# EAGLE design Schnuppi (EAGLE 7.7.0)
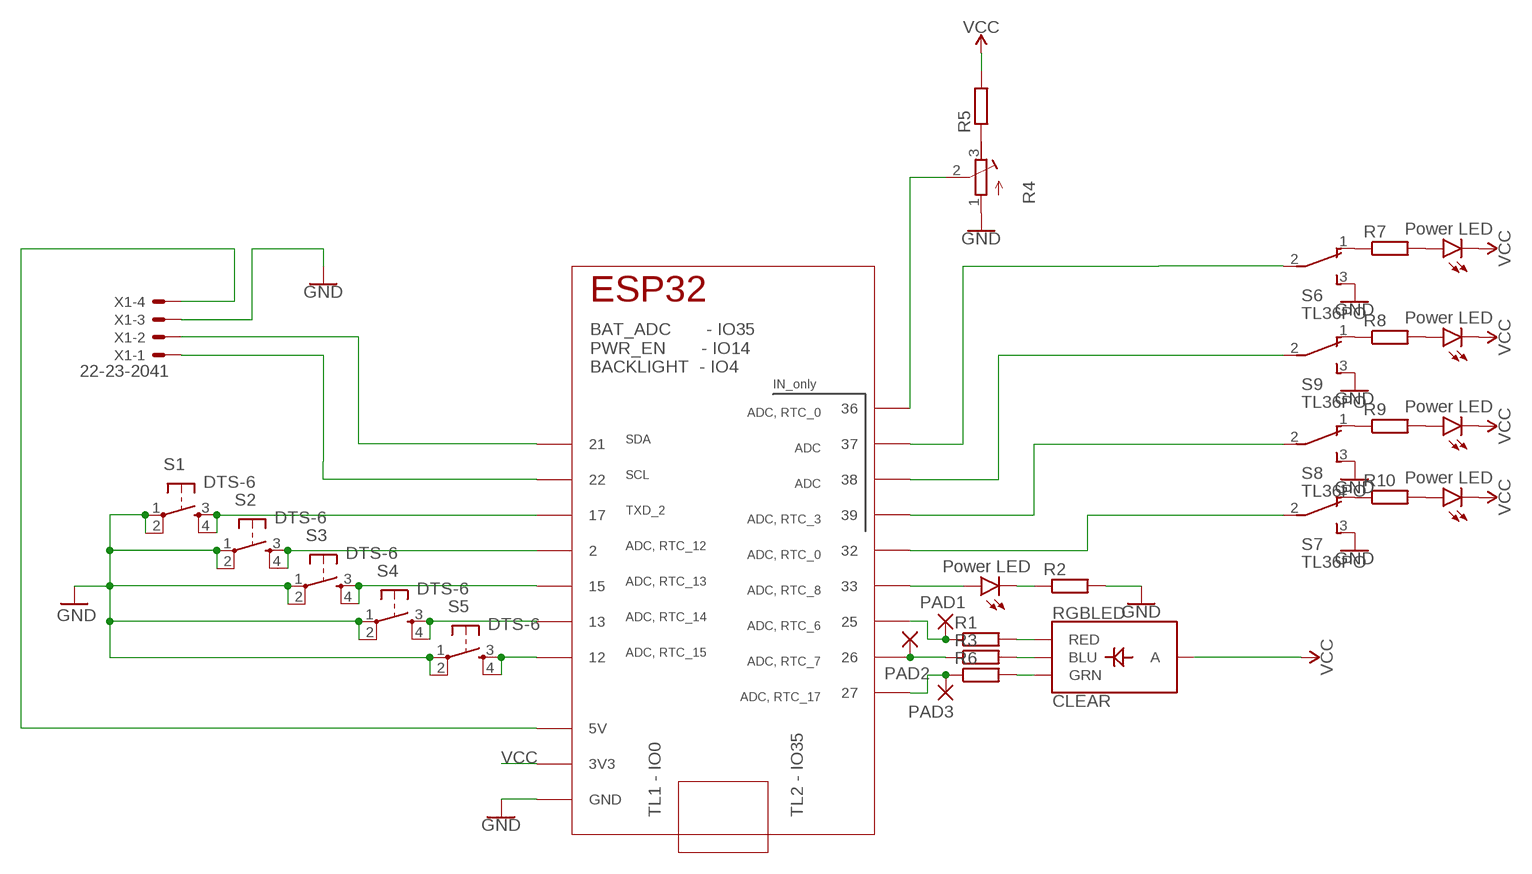
[diagram p0: schematic, sheet 1]

## Parts
IC1  TTGO_DISP  [TTGO_DISP_DEFAULT]
P1  Power LED  LED5MM  [LED_5MM]
P2  Power LED  LED5MM  [LED_5MM]
P3  Power LED  LED5MM  [LED_5MM]
P4  Power LED  LED5MM  [LED_5MM]
P5  Power LED  LED5MM  [LED_5MM]
PAD1  SMD5  [SMD2,54-5,08]
PAD2  SMD5  [SMD2,54-5,08]
PAD3  SMD5  [SMD2,54-5,08]
R1  R-EU_V234/12  [V234/12]
R2  R-EU_V234/12  [V234/12]
R3  R-EU_V234/12  [V234/12]
R4  R-TRIMM64Y  [RTRIM64Y]
R5  R-EU_V234/12  [V234/12]
R6  R-EU_V234/12  [V234/12]
R7  R-EU_V234/12  [V234/12]
R8  R-EU_V234/12  [V234/12]
R9  R-EU_V234/12  [V234/12]
R10  R-EU_V234/12  [V234/12]
RGBLED  CLEAR  LED-RGB-CACLEAR  [LED-RGB-THRU]
S1  DTS-6  [DTS-6]
S2  DTS-6  [DTS-6]
S3  DTS-6  [DTS-6]
S4  DTS-6  [DTS-6]
S5  DTS-6  [DTS-6]
S6  TL36PO  [TL3XPO]
S7  TL36PO  [TL3XPO]
S8  TL36PO  [TL3XPO]
S9  TL36PO  [TL3XPO]
X1  22-23-2041  [22-23-2041]

## Nets
GND: IC1.GND_1(GND) IC1.GND_2(GND) IC1.GND_3(GND) IC1.GND_4(GND) IC1.GND_5(GND) R2.2 R4.1(A) S1.1 S1.2 S2.1 S2.2 S3.1 S3.2 S4.1 S4.2 S5.1 S5.2 S6.3(S) S7.3(S) S8.3(S) S9.3(S)
N$1: IC1.12 S5.3 S5.4
N$2: IC1.13 S4.3 S4.4
N$3: IC1.15 S3.3 S3.4
N$4: IC1.2 S2.3 S2.4
N$5: IC1.17 S1.3 S1.4
N$6: R4.3(E) R5.1
N$7: IC1.36 R4.2(S)
N$8: IC1.25 PAD1.1(P) R1.1
N$10: IC1.27 PAD3.1(P) R6.1
N$11: IC1.26 PAD2.1(P) R3.1
N$12: IC1.33 P2.A
N$13: P2.K(C) R2.1
N$14: IC1.22 X1.1
N$15: R1.2 RGBLED.1(RED)
N$16: R3.2 RGBLED.4(BLU)
N$17: R6.2 RGBLED.3(GRN)
N$18: IC1.5V X1.4
N$19: IC1.37 S6.2(P)
N$20: IC1.39 S8.2(P)
N$21: IC1.32 S7.2(P)
N$22: IC1.38 S9.2(P)
N$23: R10.1 S7.1(O)
N$24: R9.1 S8.1(O)
N$25: R8.1 S9.1(O)
N$26: R7.1 S6.1(O)
N$27: P1.A R7.2
N$28: P3.A R8.2
N$29: P4.A R9.2
N$30: P5.A R10.2
N$31: X1.3 ; supply symbol labelled GND
N$32: IC1.21 X1.2
VCC: IC1.3V3_1(3V3) IC1.3V3_2(3V3) P1.K(C) P3.K(C) P4.K(C) P5.K(C) R5.2 RGBLED.2(A)

## Library data of the parts
IC1 = TTGO_LCD_DISP:TTGO_DISP; HEIGHT: 11
P1-P5 = SparkFun-LED:LED: LED (Generic) Standard schematic elements and footprints for 5mm, 3mm, 1206, and 0603 sized LEDs. Generic LEDs with no color specified.
PAD1-PAD3 = wirepad:SMD5: SMD PAD
R1-R3 R5-R10 = rcl:R-EU_: RESISTOR, European symbol
R4 = rcl:R-TRIMM: Trimm resistor
RGBLED = SparkFun-LED:LED-RGB-CA: LED-RGB Diffused Common Anode Packages: LED RGB-THRU P-LCC-4-3 LED-TRICOLOR-SMD SparkFun Products: RGB Diffused Common Anode- Diffuse <[https://www.sparkfun.com/products/10821]> RGB Diffused Common Anode - Clear <[https://www.sparkfun.com/products/10820]> Qduino Mini <[https://www.sparkfun.com/products/13614]> Triple Output LED RGB - SMD <https://www.sparkfun.com/products/7844>; PROD_ID: DIO-10631
S1-S5 = switch-tact:DTS-6
S6-S9 = switch:TL36PO: TINY SWITCH ON - ON Source: http://www2.produktinfo.conrad.com/datenblaetter/700000-724999/705152-da-01-de-Subminiaturschalter_TL_36YO.pdf
X1 = con-molex:22-23-2041: .100" (2.54mm) Center Header - 4 Pin; MF: MOLEX; MPN: 22-23-2041; OC_FARNELL: 1462920; OC_NEWARK: 38C0355

## Board
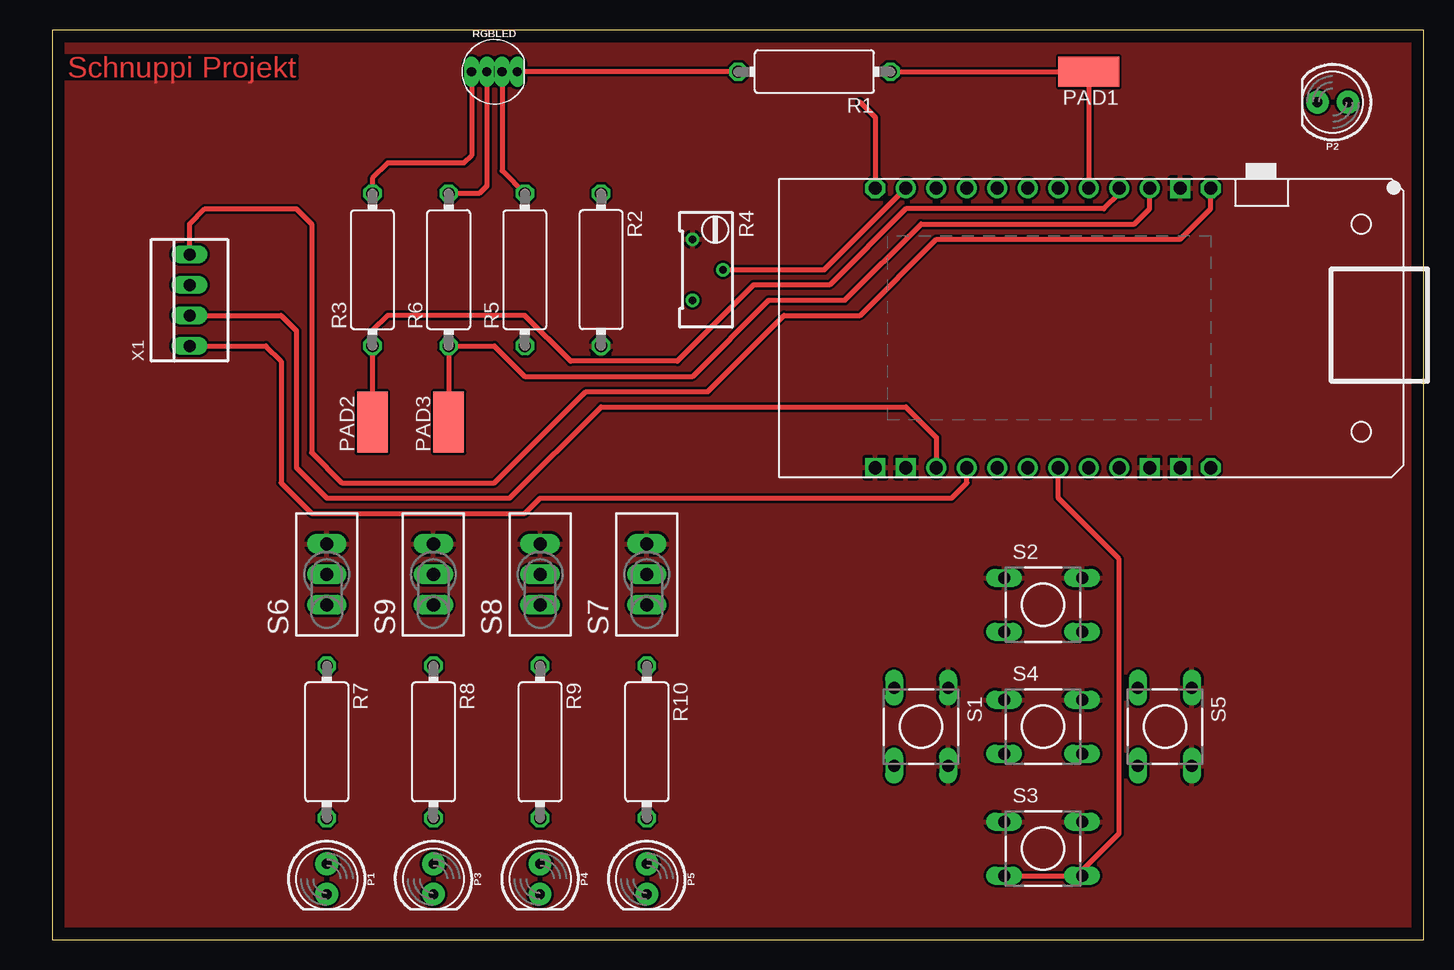
[diagram p1: board, top side]
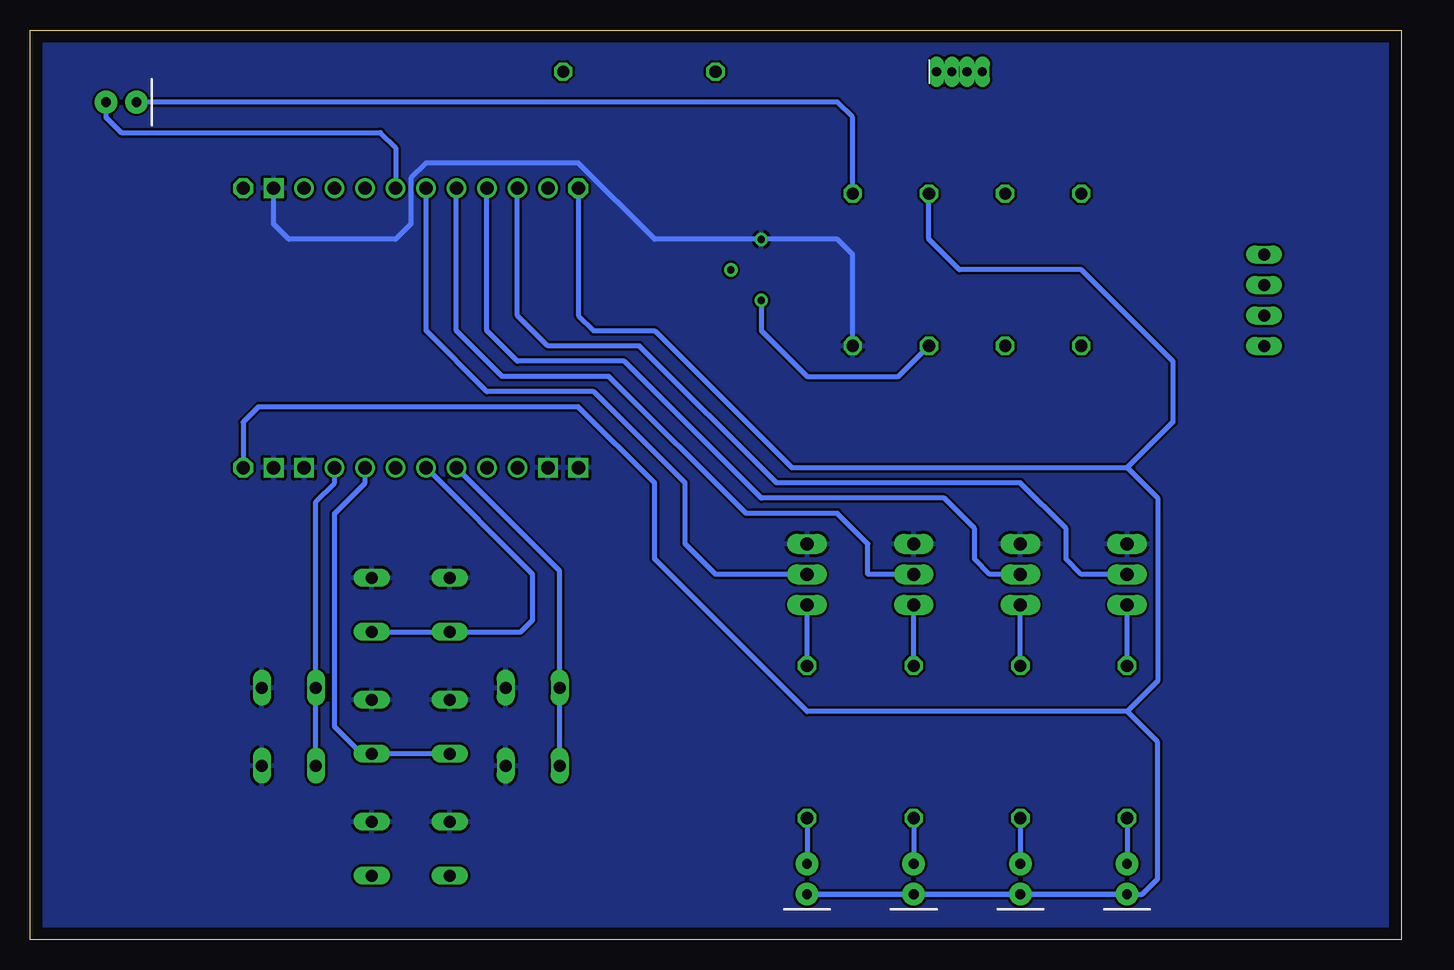
[diagram p2: board, bottom side, seen from below]

Size 114.28 x 75.87 mm. Coordinates in mm from the lower left corner, seen from the top.
Outline: 0,0 114.28,0 114.28,75.87 0,75.87 0,0
Copper layers (1*16): Top 0.035mm / dielectric 1.5mm / Bottom 0.035mm
Design rules "default": minimum track width 10mil, minimum drill 24mil, track to track 8mil, track to pad 8mil, pad to pad 8mil, via to via 8mil, smd to smd 8mil, copper to edge 40mil, drill to drill 8mil, minimum pad ring 10mil, minimum via ring 8mil, stop-mask expansion 4mil, vias tented up to drill 0mil, thermal gap 10mil

### Footprints (pad centres in the part's own frame; a part is rotated, then mirrored left to right if it is on the bottom)
TTGO_DISP_DEFAULT = drill 1.1: 2 12.7,0; 12 20.32,0; 13 17.78,0; 15 15.24,0; 17 10.16,0; 21 5.08,0; 22 7.62,0; 25 17.78,23.3; 26 20.32,23.3; 27 22.86,23.3; 32 12.7,23.3; 33 15.24,23.3; 36 2.54,23.3; 37 5.08,23.3; 38 7.62,23.3; 39 10.16,23.3 | drill 1.1 octagon: 3V3_1 0,23.3; 3V3_2 27.94,0; 5V 27.94,23.3 | drill 1.1 square: GND_1 0,0; GND_2 2.54,0; GND_3 22.86,0; GND_4 25.4,0; GND_5 25.4,23.3
LED_5MM = drill 0.813 pad 1.88: A -1.27,0; K 1.27,0
SMD2,54-5,08 = smd 2.54 x 5.08: 1 0,0
V234/12 = drill 1.016 octagon: 1 -6.35,0; 2 6.35,0
RTRIM64Y = drill 0.61: 1 0,-2.54; 2 -2.54,0; 3 0,2.54
LED-RGB-THRU = drill 0.762 pad 0.889 long: 1 1.905,0; 2 0.635,0; 3 -0.635,0; 4 -1.905,0
DTS-6 = drill 1 long: 1 -3.25,2.25; 2 3.25,2.25; 3 -3.25,-2.25; 4 3.25,-2.25
TL3XPO = drill 1.1 pad 1.422 long: 1 -2.54,0; 2 0,0; 3 2.54,0
22-23-2041 = drill 1 long: 1 -3.81,0; 2 -1.27,0; 3 1.27,0; 4 3.81,0

### Placement (x,y rotation side)
IC1  68.58,39.37 0 top
P1  22.86,5.08 270 top
P2  106.68,69.85 180 top
P3  31.75,5.08 270 top
P4  40.64,5.08 270 top
P5  49.53,5.08 270 top
PAD1  86.36,72.39 90 top
PAD2  26.67,43.18 0 top
PAD3  33.02,43.18 0 top
R1  63.5,72.39 180 top
R2  45.72,55.88 270 top
R3  26.67,55.88 90 top
R4  53.34,55.88 180 top
R5  39.37,55.88 90 top
R6  33.02,55.88 90 top
R7  22.86,16.51 270 top
R8  31.75,16.51 270 top
R9  40.64,16.51 270 top
R10  49.53,16.51 270 top
RGBLED  36.83,72.39 0 top
S1  72.39,17.78 270 top
S2  82.55,27.94 0 top
S3  82.55,7.62 0 top
S4  82.55,17.78 0 top
S5  92.71,17.78 270 top
S6  22.86,30.48 90 top
S7  49.53,30.48 90 top
S8  40.64,30.48 90 top
S9  31.75,30.48 90 top
X1  11.43,53.34 90 top

### Tracks (layer width: path | path; a pad name or v marks a point on that pad's centre or on a via)
GND
  Bottom 0.406: R2.2 45.72,57.15 46.99,58.42 R4.1 62.23,58.42 68.58,64.77 81.28,64.77 82.55,63.5 82.55,59.69 83.82,58.42 92.71,58.42 93.98,59.69 IC1.GND_5
  pour Bottom: -1.27,76.2 115.57,76.2 115.57,0 -1.27,-1.27
  pour Top: -6.35,76.2 115.57,76.2 115.57,-1.27 -5.08,-1.27
N$1
  Bottom 0.406: S5.4 S5.3 90.46,36.54 88.9,38.1 IC1.12
N$2
  Bottom 0.406: S4.3 S4.4 86.65,15.53 88.9,17.78 88.9,35.56 86.36,38.1 IC1.13
N$3
  Top 0.406: S3.3 S3.4 85.8,5.79 88.9,8.89 88.9,31.75 83.82,36.83 IC1.15
N$4
  Bottom 0.406: S2.4 S2.3 73.37,25.69 72.39,26.67 72.39,30.48 IC1.2
N$5
  Bottom 0.406: S1.4 S1.3 70.14,30.77 IC1.17
N$6
  Bottom 0.406: R4.3 53.34,50.8 49.53,46.99 41.91,46.99 R5.1
N$7
  Top 0.406: R4.2 64.33,55.88 IC1.36
N$8
  Top 0.406: R1.1 PAD1.1 IC1.25
N$10
  Top 0.406: PAD3.1 R6.1 36.83,49.53 39.37,46.99 53.34,46.99 59.69,53.34 66.04,53.34 72.39,59.69 90.17,59.69 91.44,60.96 IC1.27
N$11
  Top 0.406: PAD2.1 R3.1 26.67,50.8 27.94,52.07 39.37,52.07 43.18,48.26 52.07,48.26 58.42,54.61 64.77,54.61 71.12,60.96 87.63,60.96 88.9,62.23 IC1.26
N$12
  Bottom 0.406: IC1.33 83.82,66.04 85.09,67.31 106.68,67.31 107.95,68.58 P2.A
N$13
  Bottom 0.406: R2.1 45.72,68.58 46.99,69.85 P2.K
N$14
  Top 0.406: X1.1 17.78,49.53 19.05,48.26 19.05,38.1 21.59,35.56 39.37,35.56 40.64,36.83 74.93,36.83 76.2,38.1 IC1.22
N$15
  Top 0.406: R1.2 RGBLED.1
N$16
  Top 0.406: RGBLED.4 34.92,65.41 34.29,64.77 27.94,64.77 26.67,63.5 R3.2
N$17
  Top 0.406: RGBLED.3 36.2,62.87 35.56,62.23 R6.2
N$18
  Top 0.406: X1.4 11.43,59.69 12.7,60.96 20.32,60.96 21.59,59.69 21.59,40.64 24.13,38.1 36.83,38.1 44.45,45.72 54.61,45.72 60.96,52.07 67.31,52.07 73.66,58.42 93.98,58.42 96.52,60.96 IC1.5V
N$19
  Bottom 0.406: S6.2 26.67,30.48 27.94,31.75 27.94,34.29 31.75,38.1 52.07,38.1 63.5,49.53 71.12,49.53 73.66,52.07 IC1.37
N$20
  Bottom 0.406: S8.2 44.45,30.48 44.45,33.02 46.99,35.56 54.61,35.56 66.04,46.99 74.93,46.99 78.74,50.8 IC1.39
N$21
  Bottom 0.406: S7.2 57.15,30.48 59.69,33.02 59.69,38.1 67.31,45.72 76.2,45.72 81.28,50.8 IC1.32
N$22
  Bottom 0.406: S9.2 34.29,30.48 35.56,31.75 35.56,34.29 38.1,36.83 53.34,36.83 64.77,48.26 73.66,48.26 76.2,50.8 IC1.38
N$23
  Bottom 0.406: R10.1 S7.1
N$24
  Bottom 0.406: R9.1 S8.1
N$25
  Bottom 0.406: R8.1 S9.1
N$26
  Bottom 0.406: R7.1 S6.1
N$27
  Bottom 0.406: R7.2 P1.A
N$28
  Bottom 0.406: R8.2 P3.A
N$29
  Bottom 0.406: R9.2 P4.A
N$30
  Bottom 0.406: R10.2 P5.A
N$32
  Top 0.406: X1.2 19.05,52.07 20.32,50.8 20.32,39.37 22.86,36.83 38.1,36.83 45.72,44.45 71.12,44.45 73.66,41.91 IC1.21
VCC
  Top 0.406: 67.31,69.85 68.58,68.58 IC1.3V3_1 | RGBLED.2 37.47,64.13 R5.2
  Bottom 0.406: P1.K P3.K P4.K P5.K 21.59,3.81 20.32,5.08 20.32,16.51 22.86,19.05 | R5.2 39.37,58.42 36.83,55.88 26.67,55.88 19.05,48.26 19.05,43.18 22.86,39.37 | IC1.3V3_1 68.58,52.07 67.31,50.8 62.23,50.8 50.8,39.37 22.86,39.37 | 22.86,39.37 20.32,36.83 20.32,21.59 22.86,19.05 | 22.86,19.05 49.53,19.05 62.23,31.75 62.23,38.1 68.58,44.45 95.25,44.45 96.52,43.18 IC1.3V3_2

### Text on the board
Top: Schnuppi Projekt